# Altium schematic sheet NMT_UIO_INT.SCHDOC
size A4; Organization: Altium Limited; Address1: L3, 12a Rodborough Rd; Address2: Frenchs Forest; Address3: NSW; Address4: Australia 2086; DocumentNumber: 5; SheetNumber: 9; SheetTotal: 13
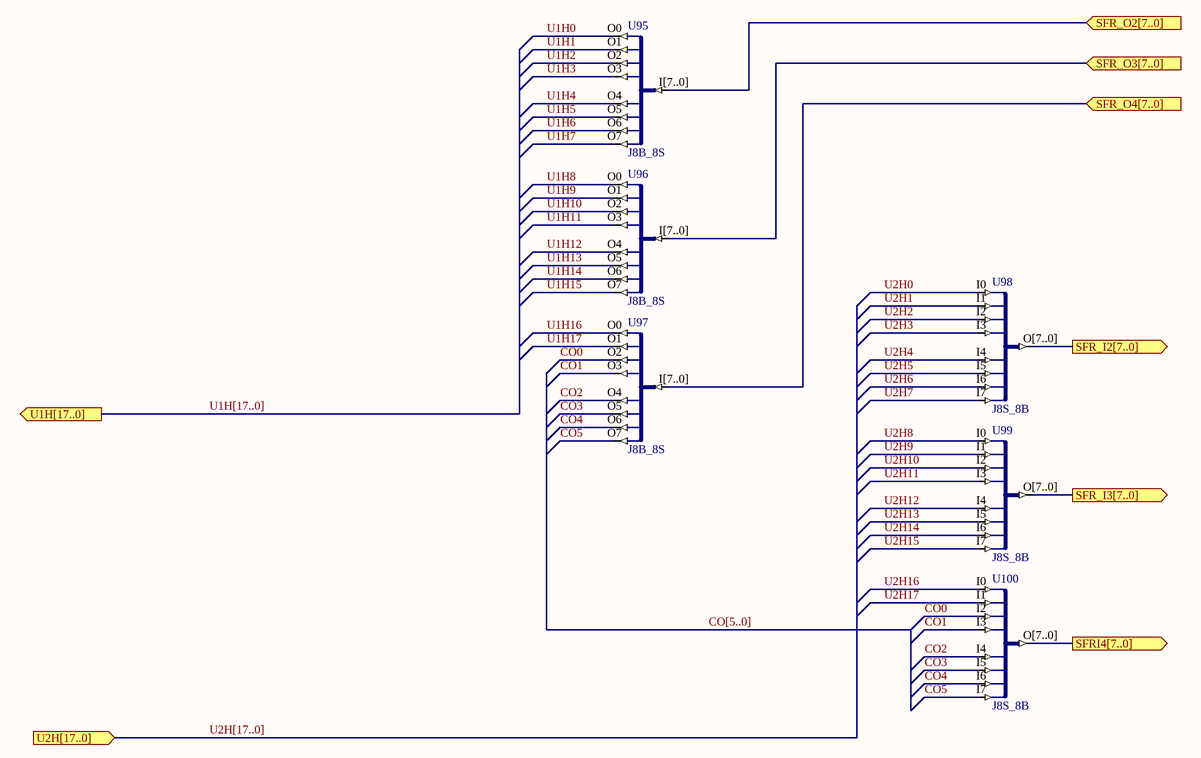
[diagram p0: NMT_UIO_INT.SCHDOC]

## Parts
U95  J8B_8S
U96  J8B_8S
U97  J8B_8S
U98  J8S_8B
U99  J8S_8B
U100  J8S_8B

## Ports
SFR_I2[7..0] (out), SFR_I3[7..0] (out), SFR_O2[7..0] (in), SFR_O3[7..0] (in), SFR_O4[7..0] (in), SFRI4[7..0] (out), U1H[17..0] (out), U2H[17..0] (in)

## Nets
CO0: U97.O2 U100.I2
CO1: U97.O3 U100.I3
CO2: U97.O4 U100.I4
CO3: U97.O5 U100.I5
CO4: U97.O6 U100.I6
CO5: U97.O7 U100.I7
SFR_I2[7..0]: U98.O[7..0] ; port SFR_I2[7..0]
SFR_I3[7..0]: U99.O[7..0] ; port SFR_I3[7..0]
SFR_O2[7..0]: U95.I[7..0] ; port SFR_O2[7..0]
SFR_O3[7..0]: U96.I[7..0] ; port SFR_O3[7..0]
SFR_O4[7..0]: U97.I[7..0] ; port SFR_O4[7..0]
SFRI4[7..0]: U100.O[7..0] ; port SFRI4[7..0]
U1H0: U95.O0
U1H1: U95.O1
U1H2: U95.O2
U1H3: U95.O3
U1H4: U95.O4
U1H5: U95.O5
U1H6: U95.O6
U1H7: U95.O7
U1H8: U96.O0
U1H9: U96.O1
U1H10: U96.O2
U1H11: U96.O3
U1H12: U96.O4
U1H13: U96.O5
U1H14: U96.O6
U1H15: U96.O7
U1H16: U97.O0
U1H17: U97.O1
U2H0: U98.I0
U2H1: U98.I1
U2H2: U98.I2
U2H3: U98.I3
U2H4: U98.I4
U2H5: U98.I5
U2H6: U98.I6
U2H7: U98.I7
U2H8: U99.I0
U2H9: U99.I1
U2H10: U99.I2
U2H11: U99.I3
U2H12: U99.I4
U2H13: U99.I5
U2H14: U99.I6
U2H15: U99.I7
U2H16: U100.I0
U2H17: U100.I1

## Buses and harness runs
bus CO[5..0]
bus U1H[17..0] = port U1H[17..0]
bus U2H[17..0] = port U2H[17..0]

## Notes on the sheet
- Title
- Size:
- Date:
- A4
- Number:
- Time:
- Revision:
- Sheet
- of
- File:

## Library data of the parts
U95-U97 = J8B_8S: 8-Bit input bus to 8 single pin outputs; ArchiveName: GENERIC; Published: 7-Nov-2003; Publisher: Altium Limited; Core Revision: 1.00.00
U98-U100 = J8S_8B: 8 Single pin inputs to single 8-Bit output bus; ArchiveName: GENERIC; Published: 7-Nov-2003; Publisher: Altium Limited; Core Revision: 1.00.00